# EAGLE design microSD-v2017 (EAGLE 7.5.0)
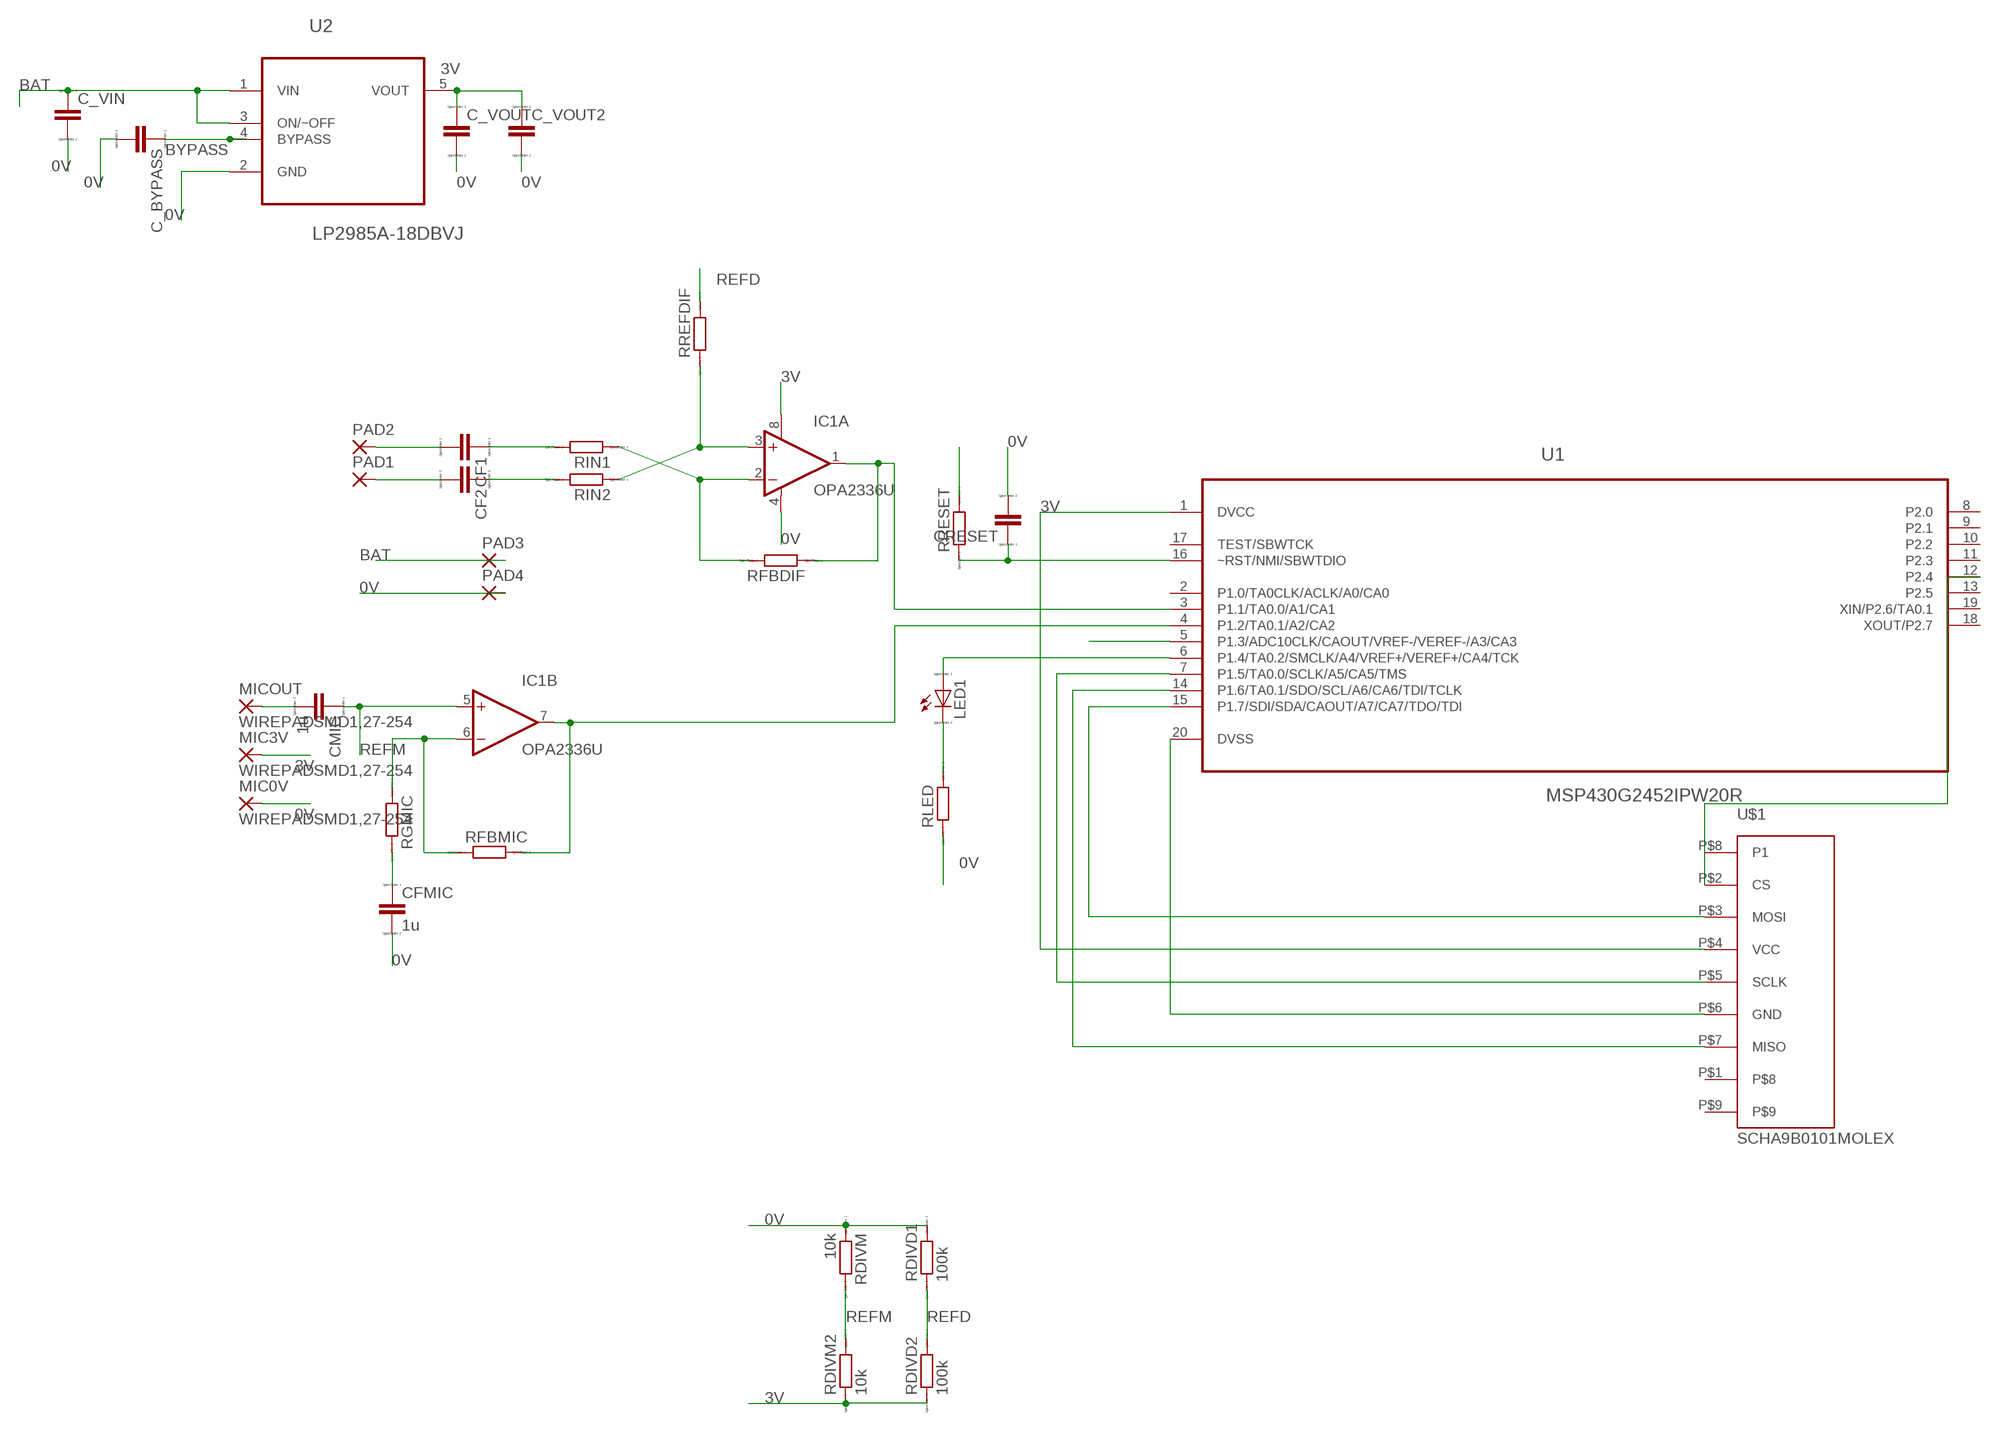
[diagram p0: schematic, sheet 1]

## Parts
C_BYPASS  C  [C0805]
C_VIN  C  [C0805]
C_VOUT  C  [C0805]
C_VOUT2  C  [C0805]
CF1  C  [C0805]
CF2  C  [C0805]
CFMIC  1u  C  [C0805]
CMIC  1u  C  [C0805]
CRESET  C  [C0805]
IC1  OPA2336U  [SO08]
LED1  LED_ESML0603  [LED_SML0603]
MIC0V  WIREPADSMD1,27-254  [SMD1,27-2,54]
MIC3V  WIREPADSMD1,27-254  [SMD1,27-2,54]
MICOUT  WIREPADSMD1,27-254  [SMD1,27-2,54]
PAD1  SMD2  [SMD1,27-2,54]
PAD2  SMD2  [SMD1,27-2,54]
PAD3  SMD2  [SMD1,27-2,54]
PAD4  SMD2  [SMD1,27-2,54]
RDIVD1  100k  R  [R0805]
RDIVD2  100k  R  [R0805]
RDIVM  10k  R  [R0805]
RDIVM2  10k  R  [R0805]
RFBDIF  R  [R0805]
RFBMIC  R  [R0805]
RGMIC  R  [R0805]
RIN1  R  [R0805]
RIN2  R  [R0805]
RLED  RR0603  [R0603]
RREFDIF  R  [R0805]
RRESET  R  [R0805]
U1  MSP430G2452IPW20R  [SOP65P640X120-20N]
U2  LP2985A-18DBVJ  [SOT95P280X145-5N]
U$1  SCHA9B0101MOLEX  [SMD-MOLEX]

## Nets
0V: C_BYPASS.2 C_VIN.2 C_VOUT2.2 C_VOUT.2 CFMIC.2 CRESET.2 IC1.4(A:V-) MIC0V.1(P) PAD4.1(P) RDIVD1.2 RDIVM.1 RLED.1 U1.20(DVSS) U2.2(GND) U$1.P$6(GND)
3V: C_VOUT2.1 C_VOUT.1 IC1.8(A:V+) MIC3V.1(P) RDIVD2.1 RDIVM2.1 RRESET.2 U1.1(DVCC) U2.5(VOUT) U$1.P$4(VCC)
BAT: C_VIN.1 PAD3.1(P) U2.1(VIN) U2.3(ON/~OFF)
BYPASS: C_BYPASS.1 U2.4(BYPASS)
LED: LED1.A U1.6(P1.4/TA0.2/SMCLK/A4/VREF+/VEREF+/CA4/TCK)
N$1: CF1.1 RIN1.2
N$2: CF2.1 RIN2.2
N$3: IC1.3(A:+IN) RIN2.1 RREFDIF.1
N$4: CRESET.1 RRESET.1 U1.16(~RST/NMI/SBWTDIO)
N$5: CF1.2 PAD2.1(P)
N$6: CF2.2 PAD1.1(P)
N$7: LED1.C RLED.2
N$8: CMIC.2 MICOUT.1(P)
N$9: U1.5(P1.3/ADC10CLK/CAOUT/VREF-/VEREF-/A3/CA3)
N$10: U1.7(P1.5/TA0.0/SCLK/A5/CA5/TMS) U$1.P$5(SCLK)
N$12: IC1.2(A:-IN) RFBDIF.2 RIN1.1
N$13: U1.14(P1.6/TA0.1/SDO/SCL/A6/CA6/TDI/TCLK) U$1.P$7(MISO)
N$14: U1.15(P1.7/SDI/SDA/CAOUT/A7/CA7/TDO/TDI) U$1.P$3(MOSI)
N$15: U1.12(P2.4) U$1.P$2(CS)
N$17: IC1.6(B:-IN) RFBMIC.1 RGMIC.1
N$19: CFMIC.1 RGMIC.2
OUTDIF: IC1.1(A:OUT) RFBDIF.1 U1.3(P1.1/TA0.0/A1/CA1)
OUTMIC: IC1.7(B:OUT) RFBMIC.2 U1.4(P1.2/TA0.1/A2/CA2)
REFD: RDIVD1.1 RDIVD2.2 RREFDIF.2
REFM: CMIC.1 IC1.5(B:+IN) RDIVM2.2 RDIVM.2
Unconnected: U1.2(P1.0/TA0CLK/ACLK/A0/CA0) U1.8(P2.0) U1.9(P2.1) U1.10(P2.2) U1.11(P2.3) U1.13(P2.5) U1.17(TEST/SBWTCK) U1.18(XOUT/P2.7) U1.19(XIN/P2.6/TA0.1) U$1.P$1 U$1.P$8(P1) U$1.P$9

## Library data of the parts
C_BYPASS C_VIN C_VOUT C_VOUT2 CF1 CF2 CFMIC CMIC CRESET = eagle-ltspice:C: CAPACITOR, European symbol; SPICEMODEL: NONE; SPICEPREFIX: C
IC1 = burr-brown:OPA2336: Single-Supply, MicroPower CMOS Operational Amplifiers MicroAmplifier Series; Product Folder:OPA2336,; MPN: OPA2336UA; OC_FARNELL: 1106183; OC_NEWARK: 24M5438
LED1 = eagle-ltspice:LED_E: LED Source: http://www.osram.convergy.de Source: www.luxeon.com Source: www.kingbright.com; SPICEMODEL: NONE; SPICEPREFIX: D; SPICETYPE: diode
MIC0V MIC3V MICOUT = wirepad:WIREPAD: Wire PAD connect wire on PCB
PAD1-PAD4 = wirepad:SMD2: SMD PAD
RDIVD1 RDIVD2 RDIVM RDIVM2 RFBDIF RFBMIC RGMIC RIN1 RIN2 RLED RREFDIF RRESET = eagle-ltspice:R: RESISTOR, European symbol; SPICEMODEL: NONE; SPICEPREFIX: R
U1 = Texas Instruments_By_element14_Batch_1:MSP430G2452IPW20R: MIXED SIGNAL MICROCONTROLLER; MPN: MSP430G2452IPW20R; OC_FARNELL: 1865387; OC_NEWARK: 21T2343; PACKAGE: TSSOP-20; SUPPLIER: TEXAS INSTRUMENTS
U2 = Texas Instruments_By_element14_Batch_1:LP2985A-18DBVJ: 150-mA LOW-NOISE LOW-DROPOUT REGULATOR; MPN: LP2985A-18DBVJ; OC_FARNELL: 1924808; OC_NEWARK: 58T1987; PACKAGE: SOT-23-5; SUPPLIER: Texas Instruments
U$1 = scha9b0101:SCHA9B0101

## Board
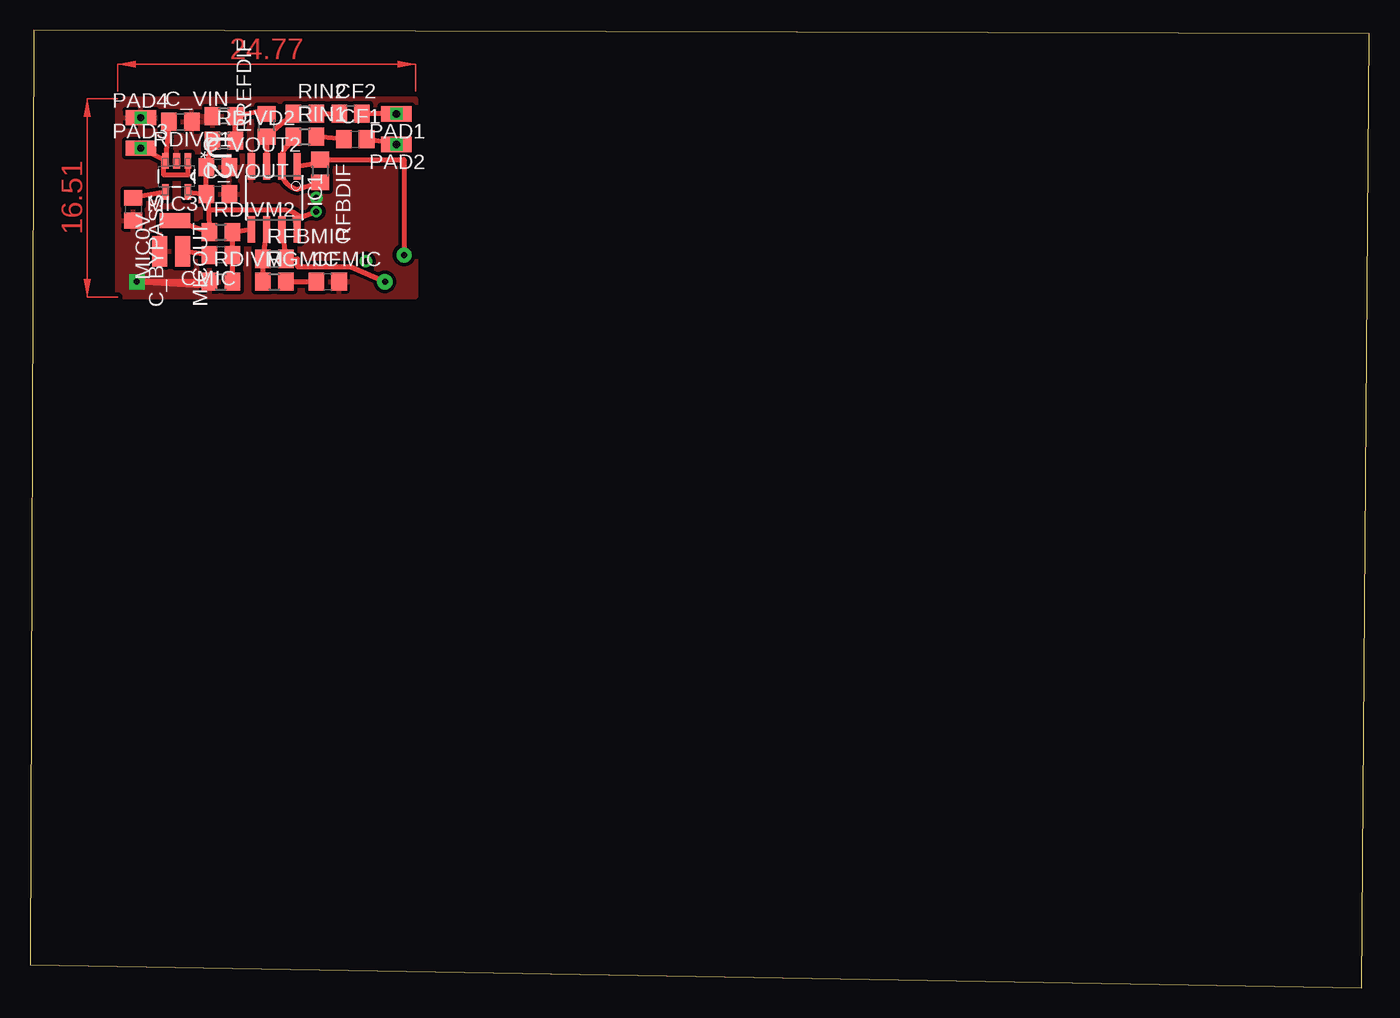
[diagram p1: board, top side]
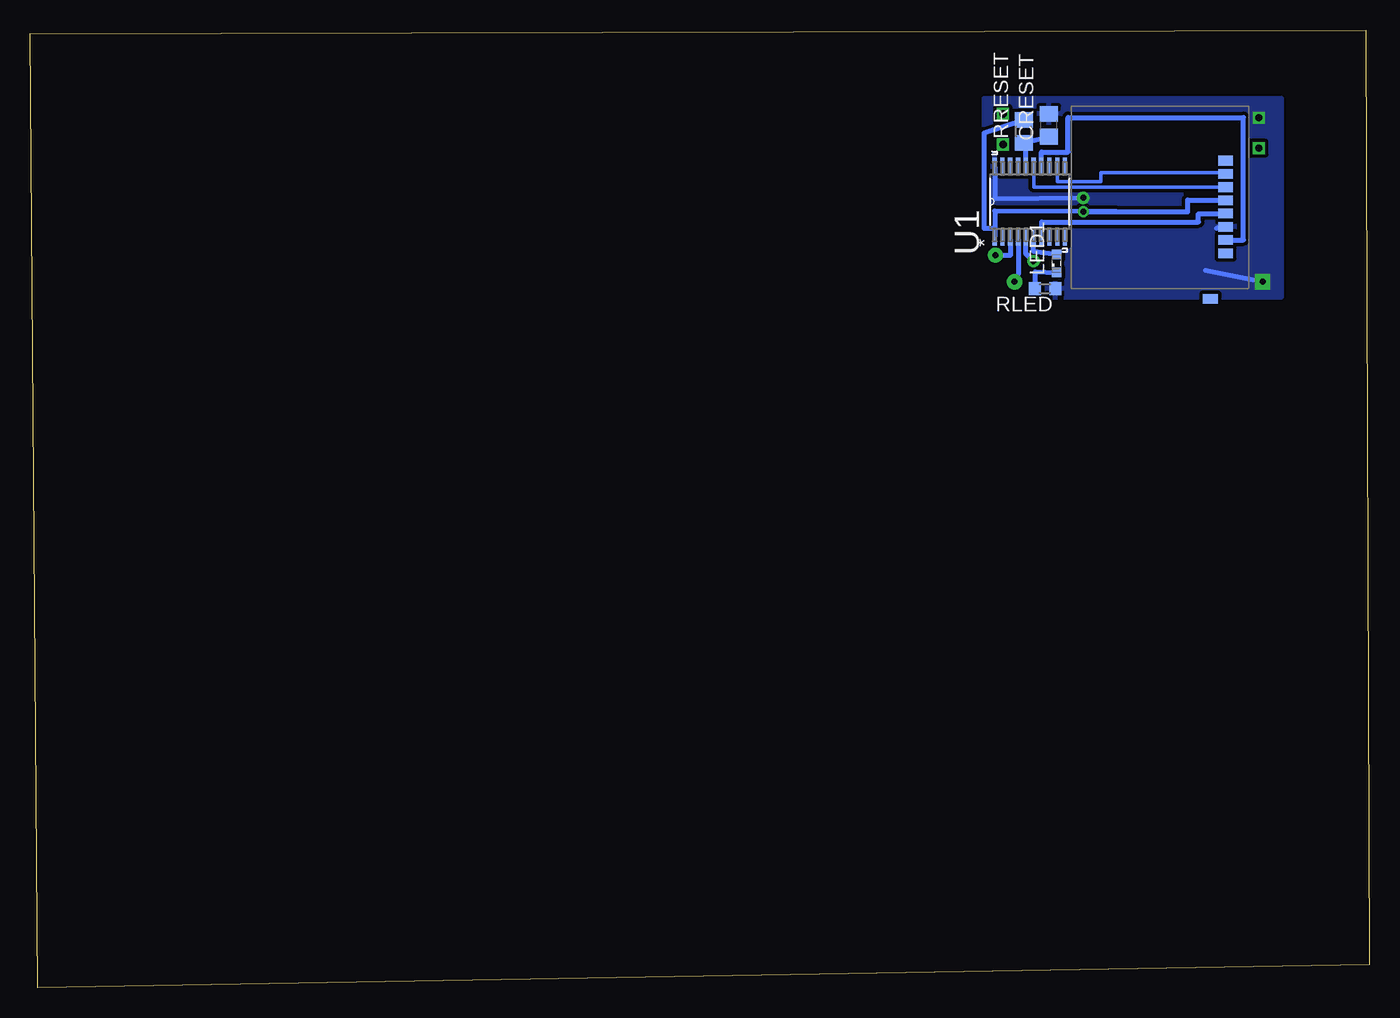
[diagram p2: board, bottom side, seen from below]

Size 111.43 x 79.68 mm. Coordinates in mm from the lower left corner, seen from the top.
Outline: 0,1.91 110.8,0 111.43,79.36 0.32,79.68 0,1.91
Copper layers (1*16): Top 0.035mm / dielectric 1.5mm / Bottom 0.035mm
Design rules "default *": minimum track width 10mil, minimum drill 24mil, track to track 12mil, track to pad 12mil, pad to pad 12mil, via to via 12mil, smd to smd 12mil, copper to edge 40mil, drill to drill 8mil, minimum pad ring 10mil, minimum via ring 8mil, stop-mask expansion 4mil, vias tented up to drill 0mil, thermal gap 10mil

### Footprints (pad centres in the part's own frame; a part is rotated, then mirrored left to right if it is on the bottom)
C0805 = smd 1.3 x 1.5: 1 -0.95,0; 2 0.95,0
SO08 = smd 0.61 x 2.21: 1 -1.905,-2.616; 2 -0.635,-2.616; 3 0.635,-2.616; 4 1.905,-2.616; 5 1.905,2.616; 6 0.635,2.616; 7 -0.635,2.616; 8 -1.905,2.616
LED_SML0603 = smd 0.8 x 0.8: A 0.75,0; C -0.75,0
SMD1,27-2,54 = smd 1.27 x 2.54: 1 0,0
R0805 = smd 1.3 x 1.5: 1 -0.95,0; 2 0.95,0
R0603 = smd 1 x 1.1: 1 -0.85,0; 2 0.85,0
SOP65P640X120-20N = smd 1.473 x 0.356: 1 -2.921,2.921; 2 -2.921,2.286; 3 -2.921,1.626; 4 -2.921,0.965; 5 -2.921,0.33; 6 -2.921,-0.33; 7 -2.921,-0.965; 8 -2.921,-1.626; 9 -2.921,-2.286; 10 -2.921,-2.921; 11 2.921,-2.921; 12 2.921,-2.286; 13 2.921,-1.626; 14 2.921,-0.965; 15 2.921,-0.33; 16 2.921,0.33; 17 2.921,0.965; 18 2.921,1.626; 19 2.921,2.286; 20 2.921,2.921
SOT95P280X145-5N = smd 1.27 x 0.559: 1 -1.295,0.94; 2 -1.295,0; 3 -1.295,-0.94; 4 1.295,-0.94; 5 1.295,0.94
SMD-MOLEX = smd 0.8 x 1.24: P$1 -6.9,2; P$2 -5.8,2; P$3 -4.7,2; P$4 -3.6,2; P$5 -2.5,2; P$6 -1.4,2; P$7 -0.3,2; P$8 0.8,2; P$9 4.61,0.73

### Placement (x,y rotation side)
C_BYPASS  8.57,64.77 270 top
C_VIN  12.51,72.07 0 top
C_VOUT  15.62,66.04 0 top
C_VOUT2  15.62,68.26 0 top
CF1  27.05,70.61 0 top
CF2  26.67,72.71 0 top
CFMIC  24.77,58.74 0 top
CMIC  15.88,60.96 180 top
CRESET  26.67,71.75 90 bottom
IC1  20.32,65.72 180 top
LED1  26.04,60.26 90 bottom
MIC0V  10.79,61.28 0 top
MIC3V  12.06,63.82 270 top
MICOUT  12.7,61.28 180 top
PAD1  30.48,72.71 90 top
PAD2  30.48,70.17 90 top
PAD3  9.21,69.85 270 top
PAD4  9.21,72.39 270 top
RDIVD1  16.13,72.52 180 top
RDIVD2  16.13,70.48 0 top
RDIVM  15.88,58.74 0 top
RDIVM2  15.88,62.87 0 top
RFBDIF  24.13,67.95 270 top
RFBMIC  20.32,60.64 0 top
RGMIC  20.32,58.74 0 top
RIN1  22.86,70.8 0 top
RIN2  22.86,72.71 0 top
RLED  26.99,58.17 180 bottom
RREFDIF  19.68,71.75 90 top
RRESET  28.77,71.25 90 bottom
U1  28.26,65.41 90 bottom
U2  12.19,67.5 270 top
U$1  13.97,61.91 270 bottom

### Tracks (layer width: path | path; a pad name or v marks a point on that pad's centre or on a via)
0V  (via drill 0.5 pad 1.02, 0.5 pad 1.27, 0.6)
  Top 0.406: RDIVM.1 v8.89,58.74 14.29,58.42
  Bottom 0.406: 13.65,59.69 v8.89,58.74 | 12.7,63.18 11.75,63.18 U$1.P$6 | U1.20 31.18,65.66 v23.81,65.72
  other vias: 9.21,72.39
  pour Top: 7.3,73.98 32.07,73.98 32.07,57.47 7.3,57.47
  pour Bottom: 7.3,73.98 32.07,73.98 32.07,57.47 7.3,57.47
3V  (via drill 0.5 pad 0.61)
  Top 0.406: C_VOUT.1 C_VOUT2.1 RDIVD2.1 | C_VOUT.1 14.77,65.97 14.92,64.7 | U2.5 C_VOUT.1 | IC1.8 21.98,64.48 | 21.98,64.48 21.27,64.7 14.92,64.7 | 14.92,64.7 RDIVM2.1 MIC3V.1 | v23.81,64.58 22.54,64.13 21.98,64.48
  Bottom 0.406: RRESET.2 32.07,71.12 32.07,63.18 31.18,63.18 | 21.02,64.57 31.18,64.62 31.18,63.18 | 31.18,63.18 U1.1 | v23.81,64.58 21.02,64.57 | 21.02,64.57 15.11,64.57 15.11,65.53 11.97,65.53 U$1.P$4
BAT  (via drill 0.6)
  Top 0.406: U2.1 13.13,67.63 11.12,67.63 11.12,68.9 | 11.12,68.9 U2.3 C_VIN.1 | PAD3.1 11.12,68.9
  other vias: 9.21,69.85
BYPASS
  Top 0.406: U2.4 C_BYPASS.1
LED
  Bottom 0.406: LED1.A 27.94,61.27 U1.6
N$1
  Top 0.406: CF1.1 RIN1.2
N$2
  Top 0.406: RIN2.2 CF2.1
N$3
  Top 0.406: IC1.3 RREFDIF.1 RIN2.1
N$4
  Bottom 0.406: CRESET.1 RRESET.1 28.59,69.84 U1.16
N$5  (via drill 0.6)
  Top 0.406: PAD2.1 CF1.2
  other vias: 30.48,70.17
N$6  (via drill 0.6)
  Top 0.406: PAD1.1 CF2.2
  other vias: 30.48,72.71
N$7
  Bottom 0.406: RLED.2 27.81,58.42 27.81,59.56 LED1.C
N$8
  Top 0.406: CMIC.2 MICOUT.1
N$9  (via drill 0.5 pad 1.02)
  Bottom 0.406: v27.94,60.45 28.59,61.1 U1.5
N$10
  Bottom 0.406: U1.7 27.29,63.71 14.22,63.71 14.22,64.39 11.97,64.39 U$1.P$5
N$12
  Top 0.406: RFBDIF.2 22.24,66.42 arc-90 IC1.2 arc-90 22.15,70.48 RIN1.1
N$13
  Bottom 0.406: U$1.P$7 10.48,62.21 10.48,72.39 25.08,72.39 25.08,69.53 27.29,69.53 U1.14
N$14
  Bottom 0.305: U$1.P$3 27.93,66.61 U1.15
N$15
  Bottom 0.305: U1.12 25.97,67.08 22.35,67.08 22.35,67.82 11.97,67.82 U$1.P$2
N$17
  Top 0.406: IC1.6 RFBMIC.1 RGMIC.1
N$19
  Top 0.406: RGMIC.2 CFMIC.1
OUTDIF  (via drill 0.5 pad 1.27)
  Top 0.406: IC1.1 24.05,68.66 arc-90 RFBDIF.1 24.45,68.9 31.11,68.9 v31.11,60.96
  Bottom 0.406: v31.11,60.96 29.84,60.96 29.84,62.19 29.88,62.19 U1.3
OUTMIC  (via drill 0.5 pad 1.27)
  Top 0.406: IC1.7 RFBMIC.2 22.23,60.64 22.23,60.01 26.67,60.01 v29.53,58.74
  Bottom 0.406: v29.53,58.74 29.21,59.37 29.21,62.23 U1.4
REFD
  Top 0.406: RDIVD2.2 RDIVD1.1 19.37,73.03 arc90 RREFDIF.2
REFM
  Top 0.406: IC1.5 RDIVM2.2 CMIC.1 RDIVM.2
(copper drawn outside any net)
  shapes: Top area x2